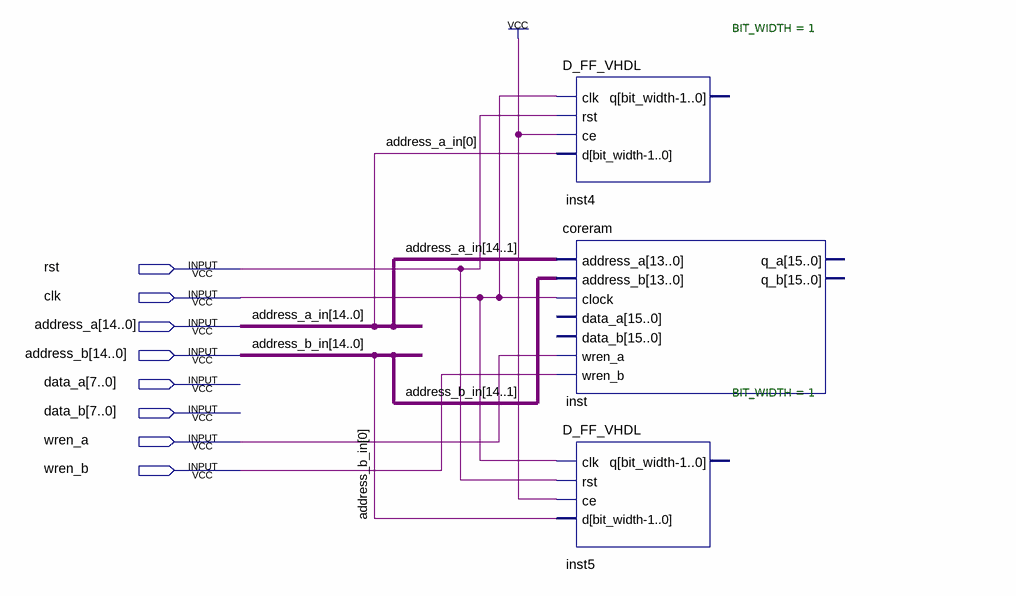
[diagram p0: schematic sheet]
// Quartus schematic internalmem.bdf as structural Verilog: 3 symbols, 8 pins
module internalmem (
  input  rst,
  input  clk,
  input  [14:0] address_a,
  input  [14:0] address_b,
  input  [7:0] data_a,
  input  [7:0] data_b,
  input  wren_a,
  input  wren_b
);

  D_FF_VHDL #(.BIT_WIDTH(1)) inst4 (.clk(clk), .rst(rst), .ce(1'b1), .d(address_a[0]));  // open: q
  coreram inst (
    .address_a(address_a[14:1]), .address_b(address_b[14:1]), .clock(clk), .wren_a(wren_a), .wren_b(wren_b));  // open: data_a, data_b, q_a, q_b
  D_FF_VHDL #(.BIT_WIDTH(1)) inst5 (.clk(clk), .rst(rst), .ce(1'b1), .d(address_b[0]));  // open: q

  // Other names for the same wires on the sheet: address_a_in[14:0] = address_a; address_b_in[14:0] = address_b
endmodule
